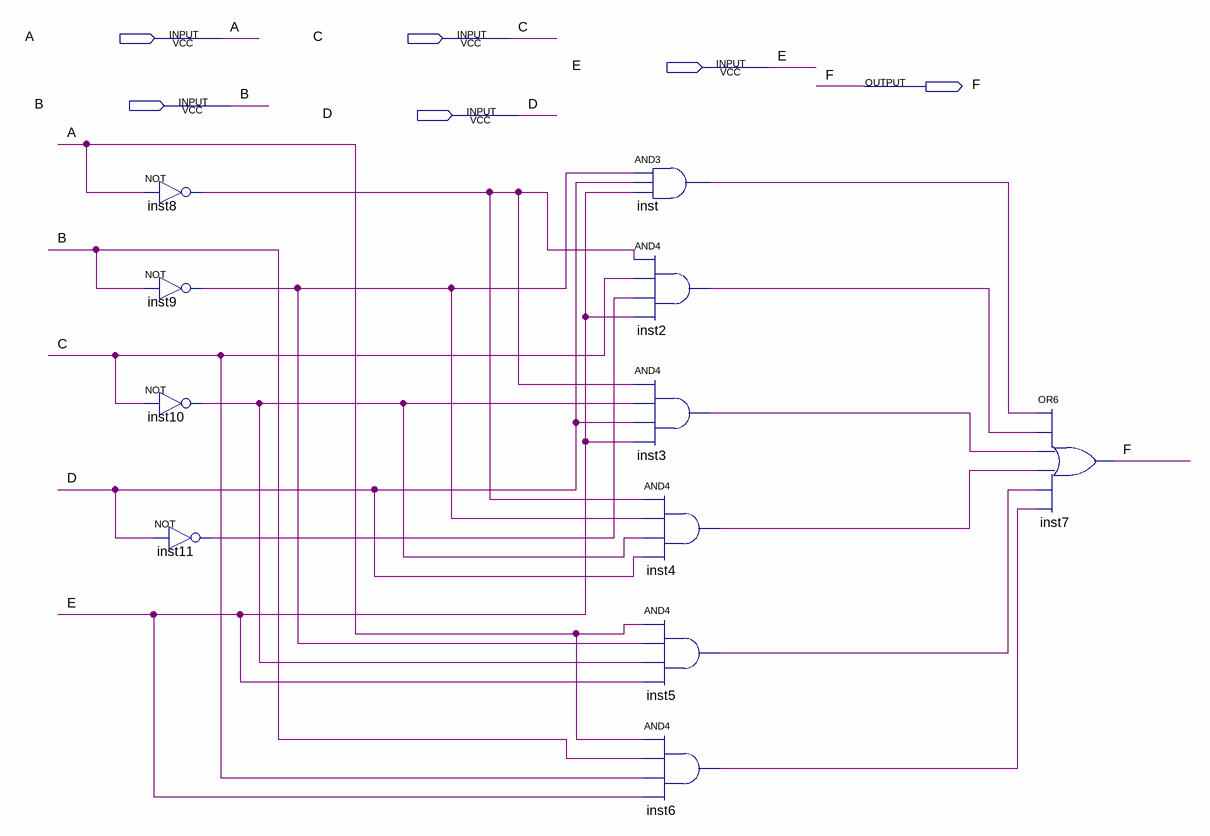
[diagram p0: schematic sheet]
// Quartus schematic prime5.bdf as structural Verilog: 11 symbols, 6 pins
module prime5 (
  input  A,
  input  C,
  input  E,
  input  B,
  input  D,
  output F
);

  wire inst2_out, inst3_out, inst4_out, inst5_out, inst6_out, inst8_out, inst9_out, inst10_out, inst11_out,
       inst_out;

  not inst8 (inst8_out, A);
  not inst9 (inst9_out, B);
  not inst10 (inst10_out, C);
  not inst11 (inst11_out, D);
  and inst (inst_out, inst9_out, D, E);
  and inst2 (inst2_out, inst8_out, C, inst11_out, E);
  and inst3 (inst3_out, inst8_out, inst10_out, D, E);
  and inst4 (inst4_out, inst8_out, inst9_out, inst10_out, D);
  and inst5 (inst5_out, A, inst9_out, inst10_out, E);
  and inst6 (inst6_out, A, B, C, E);
  or inst7 (F, inst_out, inst2_out, inst3_out, inst4_out, inst5_out, inst6_out);
endmodule
